# Altium project ALCT_MEZ_LX100.PrjPcb (part 6 of 8)

## Sheet EEPROM.SchDoc: EEPROM
size A; Organization: UCLA High Energy Physics; Address1: L3, 12a Rodborough Rd; Address2: Frenchs Forest; Address3: NSW; Address4: Australia 2086; DocumentNumber: 13; Revision: 2.0; SheetNumber: 13; SheetTotal: 23; CurrentDate: 9/6/2018; ModifiedDate: 9/6/2018; ProjectName: Project
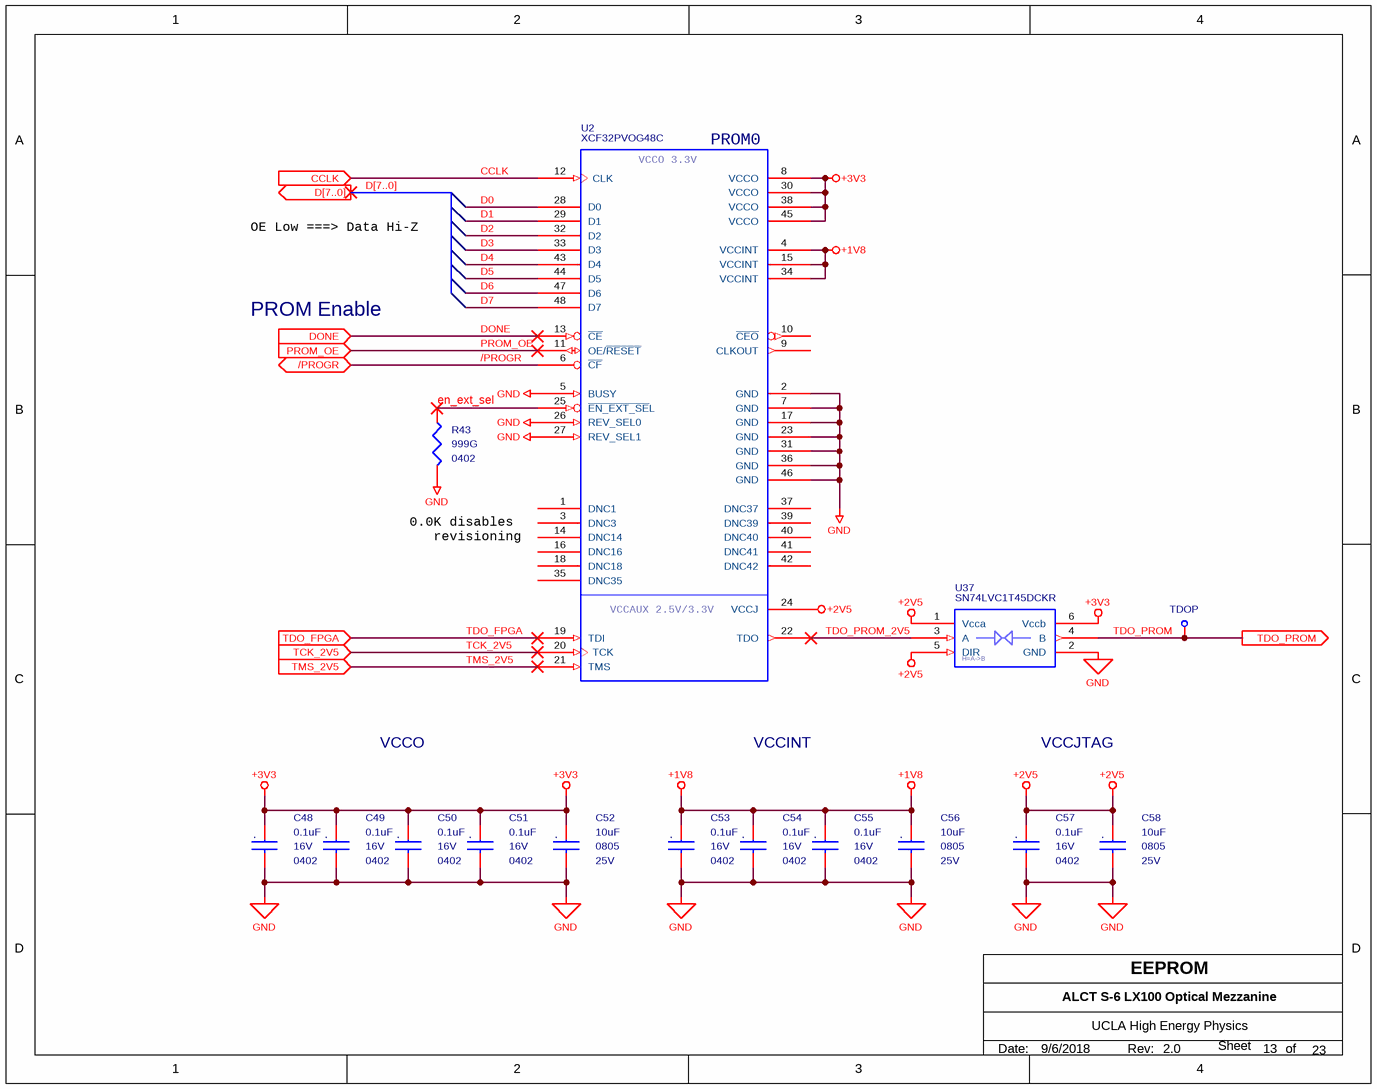
[diagram p21: EEPROM.SchDoc]

### Parts
C48  0.1uF  package: 0402  Voltage - Rated: 16V  [MC_S6/SM/C_0402_IPC]
C49  0.1uF  package: 0402  Voltage - Rated: 16V  [MC_S6/SM/C_0402_IPC]
C50  0.1uF  package: 0402  Voltage - Rated: 16V  [MC_S6/SM/C_0402_IPC]
C51  0.1uF  package: 0402  Voltage - Rated: 16V  [MC_S6/SM/C_0402_IPC]
C52  10uF  Voltage - Rated: 25V  package: 0805  [MC_S6/SM/C_0805_IPC]
C53  0.1uF  package: 0402  Voltage - Rated: 16V  [MC_S6/SM/C_0402_IPC]
C54  0.1uF  package: 0402  Voltage - Rated: 16V  [MC_S6/SM/C_0402_IPC]
C55  0.1uF  package: 0402  Voltage - Rated: 16V  [MC_S6/SM/C_0402_IPC]
C56  10uF  Voltage - Rated: 25V  package: 0805  [MC_S6/SM/C_0805_IPC]
C57  0.1uF  package: 0402  Voltage - Rated: 16V  [MC_S6/SM/C_0402_IPC]
C58  10uF  Voltage - Rated: 25V  package: 0805  [MC_S6/SM/C_0805_IPC]
R43  999G  Supplier Device Package: 0402  [MC_S6/SM/R_0402_IPC]  (no BOM)
TDOP  Test Point Via  [MC_S6/TH/TPVIA]  (value not drawn)  (no BOM)
U2  XCF32PVOG48C  [MC_S6/SM/VOG48]
U37  SN74LVC1T45DCKR  [MC_S6/SM/SOT_SC70_DCK6]

### Ports
/PROGR (bidir), CCLK (in), D[7..0] (out), DONE (in), PROM_OE (in), TCK_2V5 (in), TDO_FPGA (in), TDO_PROM (out), TMS_2V5 (in)

### Nets
+1V8: C53.1 C54.1 C55.1 C56.1 U2.4(VCCINT) U2.15(VCCINT) U2.34(VCCINT)
+2V5: C57.1 C58.1 U2.24(VCCJ) U37.1(Vcca) U37.5(DIR)
+3V3: C48.1 C49.1 C50.1 C51.1 C52.1 U2.8(VCCO) U2.30(VCCO) U2.38(VCCO) U2.45(VCCO) U37.6(Vccb)
GND: C48.2 C49.2 C50.2 C51.2 C52.2 C53.2 C54.2 C55.2 C56.2 C57.2 C58.2 R43.2 U2.2(GND) U2.5(BUSY) U2.7(GND) U2.17(GND) U2.23(GND) U2.26(REV_SEL0) U2.27(REV_SEL1) U2.31(GND) U2.36(GND) U2.46(GND) U37.2(GND)
/PROGR: U2.6(~{CF}) ; port /PROGR
CCLK: U2.12(CLK) ; port CCLK
D0: U2.28(D0)
D1: U2.29(D1)
D2: U2.32(D2)
D3: U2.33(D3)
D4: U2.43(D4)
D5: U2.44(D5)
D6: U2.47(D6)
D7: U2.48(D7)
DONE: U2.13(~{CE}) ; port DONE
en_ext_sel: R43.1 U2.25(~{EN_EXT_SE}L)
PROM_OE: U2.11(OE/~{RESET}) ; port PROM_OE
TCK_2V5: U2.20(TCK) ; port TCK_2V5
TDO_FPGA: U2.19(TDI) ; port TDO_FPGA
TDO_PROM: TDOP.1(In) U37.4(B) ; port TDO_PROM
TDO_PROM_2V5: U2.22(TDO) U37.3(A)
TMS_2V5: U2.21(TMS) ; port TMS_2V5

Not connected (* = marked no-connect by the designer): U2 1(DNC1) 3(DNC3) 9(CLKOUT) 10(~{CEO}) 14(DNC14) 16(DNC16) 18(DNC18) 35(DNC35) 37(DNC37) 39(DNC39) 40(DNC40) 41(DNC41) 42(DNC42)

### Buses and harness runs
bus D[7..0] = port D[7..0]

### Notes on the sheet
- (near U2) PROM0
- OE Low ===> Data Hi-Z
- PROM Enable
- 0.0K disables
  revisioning
- VCCO
- VCCINT
- VCCJTAG
- Date:
- Rev:
- of
- Sheet
- (in symbol C0402C104K4RACTU) .
- (in symbol GRM21BR61E106KA73L) .
- (in symbol SN74LVC1T45-EP-ALCT_1) H=A->B
- (in symbol XCF32PVOG48C) VCCO 3.3V; VCCAUX 2.5V/3.3V

### Library data of the parts
C48-C51 C53-C55 C57 = C0402C104K4RACTU: CAP CER 0.1UF 16V X7R 0402; Manufacturer: KEMET; Capacitance: 0.10µF; Tolerance: ±10%; Supplier 1: Digi-Key; Manufacturer Part Number: C0402C104K4RACTU; RoHS: RoHS Compliant; Category: Capacitors; Stock 1: 3565698; Pricing 1: 1=0.11, 10=0.078, 25=0.0568, 50=0.0442, 100=0.0365, 250=0.03024, 500=0.02562, 1000=0.02121, 5000=0.01806 (USD); Packaging: Cut Tape (CT); Part Status: Active; Operating Temperature: -55°C ~ 125°C; Features: -; Ratings: -; Applications: General Purpose; Failure Rate: -; Mounting Type: Surface Mount, MLCC; Package / Case: 0402 (1005 Metric); Size / Dimension: 0.039" L x 0.020" W (1.00mm x 0.50mm); Height - Seated (Max): -; Thickness (Max): 0.022" (0.55mm); Lead Spacing: -; Lead Style: -; ComponentLink1URL: http://www.kemet.com/docfinder?Partnumber=C0402C104K4RACTU; ComponentLink1Description: http://www.kemet.com/docfinder?Partnumber=C0402C104K4RACTU; Supplier 2: Digi-Key; Stock 2: 3565998; Pricing 2: 1=0.11, 10=0.078, 25=0.0568, 50=0.0442, 100=0.0365, 250=0.03024, 500=0.02562, 1000=0.02121, 5000=0.01806 (USD); Supplier Part Number 1: 399-3521-1-ND; Supplier Part Number 2: 399-3521-6-ND; Temperature Coefficient: X7R
C52 C56 C58 = GRM21BR61E106KA73L: CAP CER 10UF 25V X5R 0805; Manufacturer: Murata Electronics North America; Capacitance: 10µF; Tolerance: ±10%; Supplier 1: Digi-Key; Manufacturer Part Number: GRM21BR61E106KA73L; RoHS: RoHS Compliant; Category: Capacitors; Stock 1: 607428; Pricing 1: 1=0.19, 10=0.13, 50=0.0748, 100=0.0618, 250=0.052, 500=0.04356, 1000=0.03575 (USD); Packaging: Cut Tape (CT); Part Status: Active; Operating Temperature: -55°C ~ 85°C; Mounting Type: Surface Mount, MLCC; Size / Dimension: 0.079" L x 0.049" W (2.00mm x 1.25mm); Height - Seated (Max): -; Lead Spacing: -; Features: -; ComponentLink1URL: http://www.murata.com/~/media/webrenewal/support/library/catalog/products/capacitor/mlcc/c02e.pdf; ComponentLink1Description: http://www.murata.com/~/media/webrenewal/support/library/catalog/products/capacitor/mlcc/c02e.pdf; Supplier 2: Digi-Key; Supplier Part Number 1: 490-5523-1-ND; Supplier Part Number 2: 490-5523-6-ND; Package / Case: 0805 (2012 Metric); Temperature Coefficient: X5R; Ratings: -; Applications: General Purpose; Thickness (Max): 0.053" (1.35mm); Lead Style: -
R43 = RES999G 0402: RES SMD 999G OHM 5% 1/16W 0402; Manufacturer Part Number: Do Not Place
TDOP = TPVIA: COMPSIDE: TOP; COMPGROUP: 0; mfgr: Layout; COMPROT: 0; Package: 90; mfgr_id: TPVIA; mfgr_foot: TPVIA
U2 = XCF32PVOG48C: IC PROM SRL/PAR 1.8V 32M 48TSOP; Manufacturer: Xilinx Inc.; COMPSIDE: TOP; COMPGROUP: 0; COMPROT: 270; mfgr: Xilinx; mfgr_foot: VOG48; Programmable Type: In System Programmable; Memory Size: 32Mb; Voltage - Supply: 1.65 V ~ 2 V; mfgr_id: XCF32PVOG48C; Supplier 1: Digi-Key; Manufacturer Part Number: XCF32PVOG48C; RoHS: RoHS Compliant; Category: Integrated Circuits (ICs); Stock 1: 1063; Pricing 1: 1=27.23 (USD); Packaging: Tube; Part Status: Active; Operating Temperature: -40°C ~ 85°C; Package / Case: 48-TFSOP (0.724", 18.40mm Width); Supplier Device Package: 48-TSOP; ComponentLink1URL: http://www.xilinx.com/support/documentation/data_sheets/ds123.pdf; ComponentLink1Description: http://www.xilinx.com/support/documentation/data_sheets/ds123.pdf; Supplier Part Number 1: 122-1458-ND
U37 = SN74LVC1T45-EP-ALCT_1: IC BUS TRANSCVR TRI-ST SC70-6; Manufacturer: Texas Instruments; COMPSIDE: TOP; COMPGROUP: 0; COMPROT: 270; mfgr_id: SN74LVC1T45MDCKREP; mfgr: Texas Inst; mfgr_foot: DCK; Translator Type: Voltage Level; Channel Type: Bidirectional; Channels per Circuit: 1; Output Type: Tri-State, Non-Inverted; Data Rate: 420Mbps; Supplier 1: Digi-Key; Manufacturer Part Number: SN74LVC1T45DCKR; RoHS: RoHS Compliant; Category: Integrated Circuits (ICs); Stock 1: 91787; Pricing 1: 1=0.58, 10=0.494, 100=0.3692, 500=0.29004, 1000=0.22413 (USD); Packaging: Cut Tape (CT); Part Status: Active; Input Signal: -; Output Signal: -; Operating Temperature: -40°C ~ 85°C (TA); Features: -; Mounting Type: Surface Mount; Package / Case: 6-TSSOP, SC-88, SOT-363; Supplier Device Package: SC-70-6; ComponentLink1URL: http://www.ti.com/lit/ds/symlink/sn74lvc1t45.pdf; ComponentLink1Description: http://www.ti.com/lit/ds/symlink/sn74lvc1t45.pdf; Supplier 2: Digi-Key; Stock 2: 91787; Pricing 2: 1=0.58, 10=0.494, 100=0.3692, 500=0.29004, 1000=0.22413 (USD); Supplier Part Number 1: 296-16844-1-ND; Supplier Part Number 2: 296-16844-6-ND

## Sheet GBTx_Control.SchDoc: GBTx Control
size A; Organization: UCLA High Energy Physics; Address1: L3, 12a Rodborough Rd; Address2: Frenchs Forest; Address3: NSW; Address4: Australia 2086; DocumentNumber: 17; Revision: 2.0; SheetNumber: 17; SheetTotal: 23; CurrentDate: 9/6/2018; ModifiedDate: 9/6/2018; ProjectName: Project
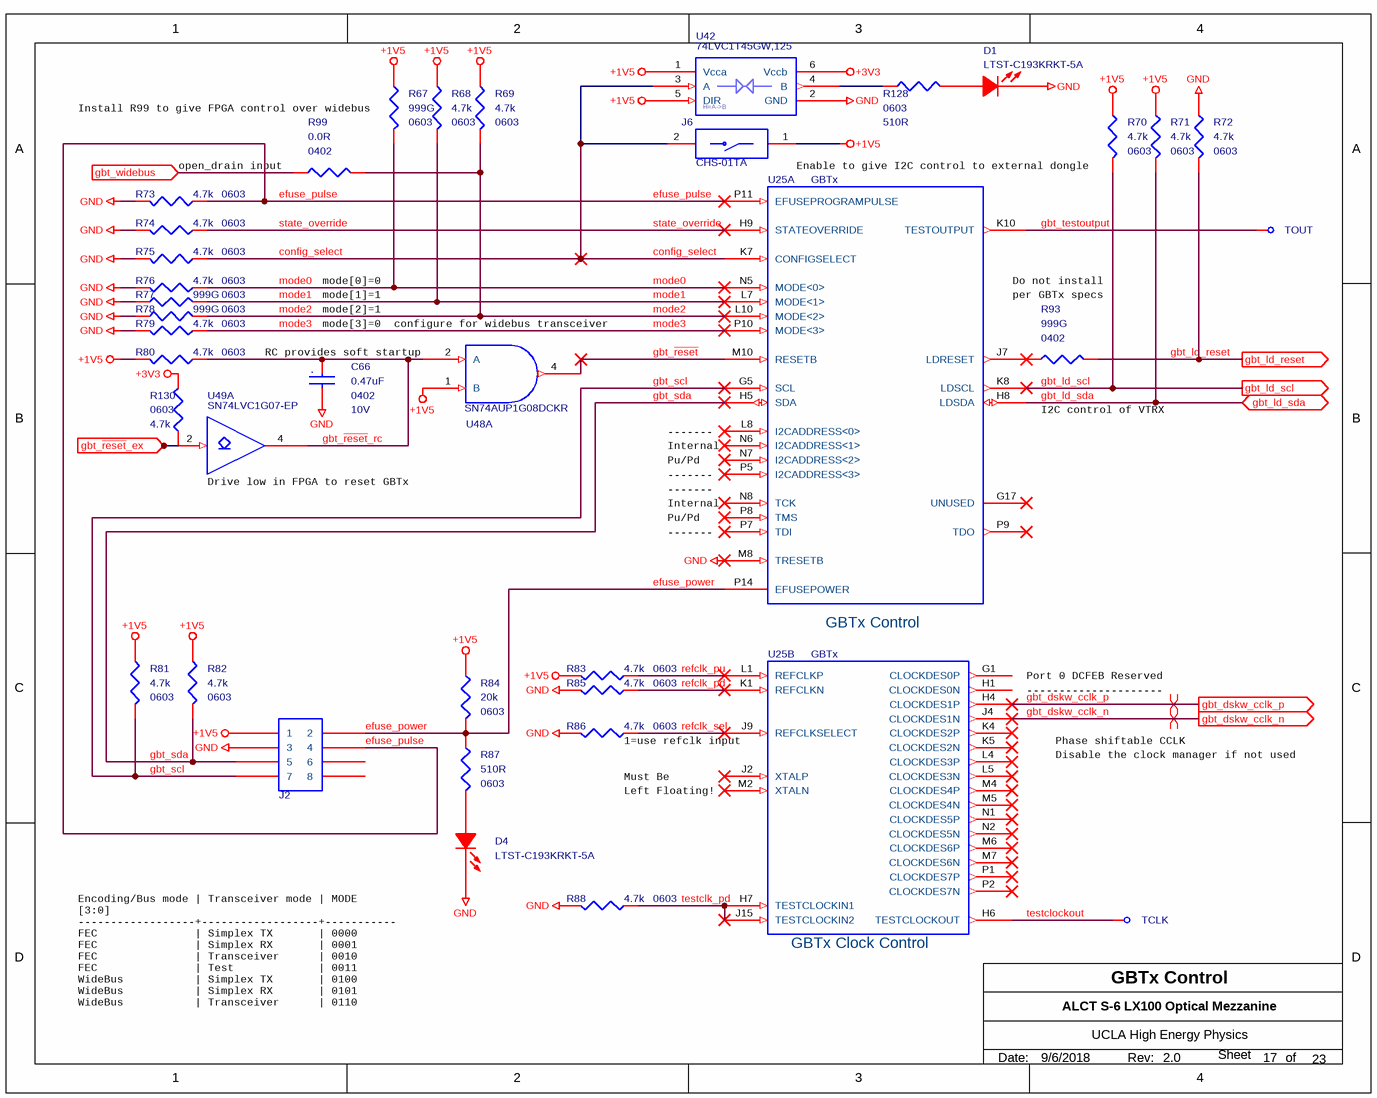
[diagram p22: GBTx_Control.SchDoc]

### Parts
C66  0.47uF  package: 0402  Voltage - Rated: 10V  [MC_S6/SM/C_0402_IPC]
D1  LTST-C193KRKT-5A  [MC_S6/SM/LED_0603]
D4  LTST-C193KRKT-5A  [MC_S6/SM/LED_0603]
J2  CON8 SMD  [MC_S6/SM/WURTH_61200820621]  (value not drawn)
J6  CHS-01TA  [CHS-01TA]
R67  999G  Supplier Device Package: 0603  [MC_S6/SM/R_0603_IPC]  (no BOM)
R68  4.7k  Supplier Device Package: 0603  [MC_S6/SM/R_0603_IPC]
R69  4.7k  Supplier Device Package: 0603  [MC_S6/SM/R_0603_IPC]
R70  4.7k  Supplier Device Package: 0603  [MC_S6/SM/R_0603_IPC]
R71  4.7k  Supplier Device Package: 0603  [MC_S6/SM/R_0603_IPC]
R72  4.7k  Supplier Device Package: 0603  [MC_S6/SM/R_0603_IPC]
R73  4.7k  Supplier Device Package: 0603  [MC_S6/SM/R_0603_IPC]
R74  4.7k  Supplier Device Package: 0603  [MC_S6/SM/R_0603_IPC]
R75  4.7k  Supplier Device Package: 0603  [MC_S6/SM/R_0603_IPC]
R76  4.7k  Supplier Device Package: 0603  [MC_S6/SM/R_0603_IPC]
R77  999G  Supplier Device Package: 0603  [MC_S6/SM/R_0603_IPC]  (no BOM)
R78  999G  Supplier Device Package: 0603  [MC_S6/SM/R_0603_IPC]  (no BOM)
R79  4.7k  Supplier Device Package: 0603  [MC_S6/SM/R_0603_IPC]
R80  4.7k  Supplier Device Package: 0603  [MC_S6/SM/R_0603_IPC]
R81  4.7k  Supplier Device Package: 0603  [MC_S6/SM/R_0603_IPC]
R82  4.7k  Supplier Device Package: 0603  [MC_S6/SM/R_0603_IPC]
R83  4.7k  Supplier Device Package: 0603  [MC_S6/SM/R_0603_IPC]
R84  20k  Supplier Device Package: 0603  [MC_S6/SM/R_0603_IPC]
R85  4.7k  Supplier Device Package: 0603  [MC_S6/SM/R_0603_IPC]
R86  4.7k  Supplier Device Package: 0603  [MC_S6/SM/R_0603_IPC]
R87  510R  Supplier Device Package: 0603  [MC_S6/SM/R_0603_IPC]
R88  4.7k  Supplier Device Package: 0603  [MC_S6/SM/R_0603_IPC]
R93  999G  Supplier Device Package: 0402  [MC_S6/SM/R_0402_IPC]  (no BOM)
R99  0.0R  Supplier Device Package: 0402  [MC_S6/SM/R_0402_IPC]
R128  510R  Supplier Device Package: 0603  [MC_S6/SM/R_0603_IPC]
R130  4.7k  Supplier Device Package: 0603  [MC_S6/SM/R_0603_IPC]
TCLK  Test Point Via  [MC_S6/TH/TPVIA]  (value not drawn)  (no BOM)
TOUT  Test Point Via  [MC_S6/TH/TPVIA]  (value not drawn)  (no BOM)
U25  GBTx  [BGA400 GBT]  (parts A,B of 8)
U42  74LVC1T45GW,125  [SOT363]
U48  SN74AUP1G08DCKR  [MC_S6/SM/SOT_SC70_DCK5]  (part A of 2)
U49  SN74LVC1G07-EP  [SOT353-1]  (part A of 2)

### Ports
gbt_dskw_cclk_n (out), gbt_dskw_cclk_p (out), gbt_ld_reset (out), gbt_ld_scl (out), gbt_ld_sda (bidir), gbt_widebus (in), gbt_~{reset}_ex (in)

### Nets
+1V5: J2.1 J6.1 R67.1 R68.1 R69.1 R70.1 R71.1 R80.2 R81.1 R82.1 R83.2 R84.1 U42.1(Vcca) U42.5(DIR) U48.1(B)
+3V3: R130.2 U42.6(Vccb)
GND: C66.2 D1.K(CATHODE) D4.K(CATHODE) J2.3 R72.1 R73.2 R74.2 R75.2 R76.2 R77.1 R78.1 R79.2 R85.2 R86.2 R88.2 U25.M8(TRESETB) U42.2(GND)
config_select: J6.2 R75.1 U25.K7(CONFIGSELECT) U42.3(A)
efuse_power: J2.2 R84.2 R87.1 U25.P14(EFUSEPOWER)
efuse_pulse: J2.4 R73.1 U25.P11(EFUSEPROGRAMPULSE)
gbt_dskw_cclk_n: U25.J4(CLOCKDES1N) ; port gbt_dskw_cclk_n
gbt_dskw_cclk_p: U25.H4(CLOCKDES1P) ; port gbt_dskw_cclk_p
gbt_ld_reset: R72.2 R93.2 ; port gbt_ld_reset
gbt_ld_scl: R70.2 U25.K8(LDSCL) ; port gbt_ld_scl
gbt_ld_sda: R71.2 U25.H8(LDSDA) ; port gbt_ld_sda
gbt_~{reset}: U25.M10(RESETB) U48.4(Y)
gbt_~{reset}_ex: R130.1 U49.2(A) ; port gbt_~{reset}_ex
gbt_~{reset}_rc: C66.1 R80.1 U48.2(A) U49.4(Y)
gbt_scl: J2.7 R81.2 U25.G5(SCL)
gbt_sda: J2.5 R82.2 U25.H5(SDA)
gbt_testoutput: TOUT.1(In) U25.K10(TESTOUTPUT)
gbt_widebus: R99.1 ; port gbt_widebus
mode0: R67.2 R76.1 U25.N5(MODE<0>)
mode1: R68.2 R77.2 U25.L7(MODE<1>)
mode2: R69.2 R78.2 R99.2 U25.L10(MODE<2>)
mode3: R79.1 U25.P10(MODE<3>)
refclk_pd: R85.1 U25.K1(REFCLKN)
refclk_pu: R83.1 U25.L1(REFCLKP)
refclk_sel: R86.1 U25.J9(REFCLKSELECT)
state_override: R74.1 U25.H9(STATEOVERRIDE)
testclk_pd: R88.1 U25.H7(TESTCLOCKIN1) U25.J15(TESTCLOCKIN2)
testclockout: TCLK.1(In) U25.H6(TESTCLOCKOUT)
NetD1_A: D1.A(ANODE) R128.2
NetD4_A: D4.A(ANODE) R87.2
NetR93_1: R93.1 U25.J7(LDRESET)
NetR128_1: R128.1 U42.4(B)

Not connected (* = marked no-connect by the designer): J2 6 8; U25 G1(CLOCKDES0P) G17(UNUSED)* H1(CLOCKDES0N) J2(XTALP)* K4(CLOCKDES2P)* K5(CLOCKDES2N)* L4(CLOCKDES3P)* L5(CLOCKDES3N)* L8(I2CADDRESS<0>)* M2(XTALN)* M4(CLOCKDES4P)* M5(CLOCKDES4N)* M6(CLOCKDES6P)* M7(CLOCKDES6N)* N1(CLOCKDES5P)* N2(CLOCKDES5N)* N6(I2CADDRESS<1>)* N7(I2CADDRESS<2>)* N8(TCK)* P1(CLOCKDES7P)* P2(CLOCKDES7N)* P5(I2CADDRESS<3>)* P7(TDI)* P8(TMS)* P9(TDO)*

### Layout directives
differential pair: gbt_dskw_cclk_n, gbt_dskw_cclk_p

### Notes on the sheet
- Install R99 to give FPGA control over widebus
- open_drain input
- Enable to give I2C control to external dongle
- mode[0]=0
- mode[1]=1
- mode[2]=1
- (near C66) mode[3]=0
- (near U48) configure for widebus transceiver
- (near U25) Do not install
- (near U25) per GBTx specs
- (near C66) RC provides soft startup
- Pu/Pd
- Internal
- -------
- I2C control of VTRX
- (near U49) Drive low in FPGA to reset GBTx
- Port 0 DCFEB Reserved
- ---------------------
- (near R86) 1=use refclk input
- Phase shiftable CCLK
- Disable the clock manager if not used
- Left Floating!
- (near R86) Must Be
- Encoding/Bus mode | Transceiver mode | MODE [3:0]
  ------------------+------------------+-----------
  FEC               | Simplex TX       | 0000
  FEC               | Simplex RX       | 0001
  FEC               | Transceiver      | 0010
  FEC               | Test             | 0011
  WideBus           | Simplex TX       | 0100
  WideBus           | Simplex RX       | 0101
  WideBus           | Transceiver      | 0110
- Date:
- Rev:
- of
- Sheet
- (in symbol 74LVC1T45) H=A->B
- (in symbol GBTx, part A) GBTx Control
- (in symbol GBTx, part B) GBTx Clock Control
- (in symbol GRM155R61A474KE15J) .

### Library data of the parts
C66 = GRM155R61A474KE15J: CAP CER 0.47UF 10V X5R 0402; Manufacturer: Murata Electronics North America; Capacitance: 0.47µF; Tolerance: ±10%; Supplier 1: Digi-Key; Manufacturer Part Number: GRM155R61A474KE15J; RoHS: RoHS Compliant; Category: Capacitors; Stock 1: 35266; Pricing 1: 1=0.1, 10=0.074, 100=0.0329, 500=0.02348, 1000=0.01845, 2500=0.01678, 5000=0.01543 (USD); Packaging: Cut Tape (CT); Part Status: Active; Operating Temperature: -55°C ~ 85°C; Features: -; Ratings: -; Applications: General Purpose; Mounting Type: Surface Mount, MLCC; Package / Case: 0402 (1005 Metric); Size / Dimension: 0.039" L x 0.020" W (1.00mm x 0.50mm); Height - Seated (Max): -; Thickness (Max): 0.022" (0.55mm); Lead Spacing: -; ComponentLink1URL: http://www.murata.com/~/media/webrenewal/support/library/catalog/products/capacitor/mlcc/c02e.ashx; ComponentLink1Description: http://www.murata.com/~/media/webrenewal/support/library/catalog/products/capacitor/mlcc/c02e.ashx; Supplier 2: Digi-Key; Stock 2: 35286; Pricing 2: 1=0.1, 10=0.074, 100=0.0329, 500=0.02348, 1000=0.01845, 2500=0.01678, 5000=0.01543 (USD); Supplier Part Number 1: 490-6305-1-ND; Supplier Part Number 2: 490-6305-6-ND; Temperature Coefficient: X5R
D1 D4 = LTST-C193KRKT-5A: LED RED CLEAR 0603 SMD; Manufacturer: Lite-On Inc.; Current - Test: 5mA; Lens Color: Colorless; Lens Style/Size: Rectangle with Flat Top, 1.15mm x 0.80mm; Millicandela Rating: 26.05mcd; Viewing Angle: 130°; Voltage - Forward (Vf) (Typ): 2V; Wavelength - Dominant: 631nm; Wavelength - Peak: 639nm; Category: Optoelectronics; Color: Red; ComponentLink1Description: http://optoelectronics.liteon.com/upload/download/DS22-2005-077/LTST-C193KRKT-5A.PDF; ComponentLink1URL: http://optoelectronics.liteon.com/upload/download/DS22-2005-077/LTST-C193KRKT-5A.PDF; Features: -; Height (Max): 0.45mm; Lens Transparency: Clear; Manufacturer Part Number: LTST-C193KRKT-5A; Mounting Type: Surface Mount; Package / Case: 0603 (1608 Metric); Packaging: Cut Tape (CT); Part Status: Active; Pricing 1: 1=0.41, 10=0.296, 25=0.2268, 100=0.148, 250=0.10852, 500=0.0921, 1000=0.07565, 2500=0.06578 (USD); Pricing 2: 1=0.41, 10=0.296, 25=0.2268, 100=0.148, 250=0.10852, 500=0.0921, 1000=0.07565, 2500=0.06578 (USD); RoHS: RoHS Compliant; Size / Dimension: 1.60mm L x 0.80mm W; Stock 1: 97257; Stock 2: 97257; Supplier 1: Digi-Key; Supplier 2: Digi-Key; Supplier Device Package: Chip LED; Supplier Part Number 1: 160-1830-1-ND; Supplier Part Number 2: 160-1830-6-ND
J2 = CON8 Wurth 61200820621: CONN HEADER 8 POS 2.54 SMD; Manufacturer: Wurth Electronics Inc.; Pitch - Mating: 0.100" (2.54mm); Number of Positions: 8; Number of Positions Loaded: All; Style: Board to Cable/Wire; Shrouding: Shrouded - 4 Wall; Contact Length - Mating: 0.200" (5.08mm); Material Flammability Rating: UL94 V-0; Current Rating: 3A; Voltage Rating: 250V; Supplier 1: Digi-Key; Manufacturer Part Number: 61200820621; RoHS: RoHS Compliant; Category: Connectors, Interconnects; Stock 1: 428; Pricing 1: 1=3.48, 100=3.1239, 500=2.6433 (USD); Packaging: Tube; Part Status: Active; Connector Type: Header; Contact Type: Male Pin; Number of Rows: 2; Row Spacing - Mating: 0.100" (2.54mm); Mounting Type: Surface Mount; Termination: Solder; Fastening Type: Push-Pull; Contact Length - Post: -; Overall Contact Length: -; Insulation Height: 0.365" (9.27mm); Contact Shape: Square; Contact Finish - Mating: Gold; Contact Finish Thickness - Mating: -; Contact Finish - Post: -; Contact Material: Copper Alloy; Insulation Material: Polyamide (PA6T), Nylon 6T; Features: Keying Slot, Pick and Place; Operating Temperature: -40°C ~ 125°C; Ingress Protection: -; Insulation Color: Black; Mated Stacking Heights: -; Contact Finish Thickness - Post: -; Applications: -; ComponentLink1URL: http://katalog.we-online.de/em/datasheet/6120xx20621.pdf; ComponentLink1Description: http://katalog.we-online.de/em/datasheet/6120xx20621.pdf; Supplier Part Number 1: 732-5476-5-ND
J6 = CHS-01TA: as J3-J5 on sheet Source_Select; ComponentLink1URL: https://www.ctscorp.com/wp-content/uploads/219.pdf; ComponentLink1Description: https://www.ctscorp.com/wp-content/uploads/219.pdf; Supplier 1: Digi-Key; Manufacturer Part Number: CHS-01TA; Stock 1: 148558; Pricing 1: 1=0.98, 10=0.961, 25=0.9056, 50=0.85, 100=0.8131, 250=0.77616, 500=0.70224 (USD); Mount: Surface Mount; Contact Material: Copper Alloy; Contact Plating: Gold; Min Operating Temperature: -40°C; Max Operating Temperature: 85°C; Packaging: Tape and Reel; Throw Configuration: SPST; Voltage Rating (DC): 6V; Current Rating: 100mA; Termination: J-Hook; Orientation: Vertical; Length: 0.098inch; Lead Free: Lead Free; ComponentLink2URL: https://datasheet.ciiva.com/2863/chs-2863448.pdf; ComponentLink2Description: https://datasheet.ciiva.com/2863/chs-2863448.pdf; ComponentLink3URL: https://datasheet.ciiva.com/2863/chs-2863449.pdf; ComponentLink3Description: https://datasheet.ciiva.com/2863/chs-2863449.pdf; ComponentLink4URL: https://datasheet.ciiva.com/2863/chs-2863450.pdf; ComponentLink4Description: https://datasheet.ciiva.com/2863/chs-2863450.pdf; Supplier Part Number 1: 563-1003-1-ND
R67 R77 = RES999G 0603: RES SMD 999G OHM 5% 1/10W 0603; Manufacturer Part Number: Do Not Place
R68-R76 R79-R83 R85 R86 R88 R130 = CR0603-FX-4701ELF: as R44-R50 on sheet Source_Select; Supplier 1: Digi-Key; Manufacturer Part Number: CR0603-FX-4701ELF; RoHS: RoHS Compliant; Category: Resistors; Stock 1: 43560; Pricing 1: 1=0.1, 10=0.021, 100=0.0086, 1000=0.00385, 2500=0.00334 (USD); Packaging: Cut Tape (CT); Part Status: Active; Resistance (Ohms): 4.7k; Tolerance: ±1%; Composition: Thick Film; Features: Moisture Resistant; Operating Temperature: -55°C ~ 155°C; Package / Case: 0603 (1608 Metric); Size / Dimension: 0.063" L x 0.031" W (1.60mm x 0.80mm); Height - Seated (Max): 0.022" (0.55mm); Failure Rate: -; ComponentLink1URL: http://www.bourns.com/docs/Product-Datasheets/CHPREZTR.pdf; ComponentLink1Description: http://www.bourns.com/docs/Product-Datasheets/CHPREZTR.pdf; Supplier 2: Digi-Key; Stock 2: 43560; Pricing 2: 1=0.1, 10=0.021, 100=0.0086, 1000=0.00385, 2500=0.00334 (USD); Supplier Part Number 1: CR0603-FX-4701ELFCT-ND; Supplier Part Number 2: CR0603-FX-4701ELFDKR-ND
R78 = RES999G: RES SMD 999G OHM 5% 1/10W 0603; Manufacturer Part Number: Do Not Place
R84 = CR0603-FX-2002ELF: RES SMD 20K OHM 1% 1/10W 0603; Manufacturer: Bourns Inc.; Power (Watts): 0.1W, 1/10W; Temperature Coefficient: ±100ppm/°C; Category: Resistors; ComponentLink1Description: http://www.bourns.com/docs/Product-Datasheets/CHPREZTR.pdf; ComponentLink1URL: http://www.bourns.com/docs/Product-Datasheets/CHPREZTR.pdf; Composition: Thick Film; Failure Rate: -; Features: Moisture Resistant; Height - Seated (Max): 0.022" (0.55mm); Manufacturer Part Number: CR0603-FX-2002ELF; Operating Temperature: -55°C ~ 155°C; Package / Case: 0603 (1608 Metric); Packaging: Cut Tape (CT); Part Status: Active; Pricing 1: 1=0.1, 10=0.021, 100=0.0086, 1000=0.00385, 2500=0.00334 (USD); Pricing 2: 1=0.1, 10=0.021, 100=0.0086, 1000=0.00385, 2500=0.00334 (USD); RoHS: RoHS Compliant; Size / Dimension: 0.063" L x 0.032" W (1.60mm x 0.80mm); Stock 1: 1108; Stock 2: 1108; Supplier 1: Digi-Key; Supplier 2: Digi-Key; Supplier Part Number 1: CR0603-FX-2002ELFCT-ND; Supplier Part Number 2: CR0603-FX-2002ELFDKR-ND; Tolerance: ±1%
R87 R128 = CR0603-FX-5100ELF: RES SMD 510 OHM 1% 1/10W 0603; Manufacturer: Bourns Inc.; Power (Watts): 0.1W, 1/10W; Temperature Coefficient: ±100ppm/°C; Supplier 1: Digi-Key; Manufacturer Part Number: CR0603-FX-5100ELF; RoHS: RoHS Compliant; Category: Resistors; Stock 1: 523; Pricing 1: 1=0.1, 10=0.021, 100=0.0086, 1000=0.00385, 2500=0.00334 (USD); Packaging: Digi-Reel®; Part Status: Active; Composition: Thick Film; Features: Moisture Resistant; Operating Temperature: -55°C ~ 155°C; Package / Case: 0603 (1608 Metric); Size / Dimension: 0.063" L x 0.032" W (1.60mm x 0.80mm); Height - Seated (Max): 0.022" (0.55mm); Failure Rate: -; ComponentLink1URL: https://www.bourns.com/docs/Product-Datasheets/CHPREZTR.pdf; ComponentLink1Description: https://www.bourns.com/docs/Product-Datasheets/CHPREZTR.pdf; Supplier Part Number 1: CR0603-FX-5100ELFDKR-ND; Tolerance: ±1%
R93 = RES999G 0402: as R43 on sheet EEPROM
R99 = RC1005J000CS: RES SMD 0.0OHM JUMPER 1/16W 0402; Manufacturer: Samsung Electro-Mechanics America, Inc.; Resistance (Ohms): 0.0; Power (Watts): 0.063W, 1/16W; Manufacturer Part Number: RC1005J000CS; Supplier 1: Digi-Key; RoHS: RoHS Compliant; Category: Resistors; Stock 1: 3176408; Pricing 1: 1=0.1, 10=0.01, 25=0.0076, 50=0.0056, 100=0.0042, 250=0.0032, 500=0.00256, 1000=0.00188, 5000=0.00135 (USD); Packaging: Cut Tape (CT); Part Status: Active; Tolerance: Jumper; Composition: Thick Film; Features: Moisture Resistant; Temperature Coefficient: -; Operating Temperature: -55°C ~ 155°C; Package / Case: 0402 (1005 Metric); Size / Dimension: 0.039" L x 0.020" W (1.00mm x 0.50mm); Height - Seated (Max): 0.016" (0.40mm); Failure Rate: -; ComponentLink1URL: http://www.samsungsem.com/kr/support/library/product-catalog/chip_resistor.jsp; ComponentLink1Description: http://www.samsungsem.com/kr/support/library/product-catalog/chip_resistor.jsp; Supplier 2: Digi-Key; Stock 2: 3176408; Pricing 2: 1=0.1, 10=0.01, 25=0.0076, 50=0.0056, 100=0.0042, 250=0.0032, 500=0.00256, 1000=0.00188, 5000=0.00135 (USD); Supplier Part Number 1: 1276-3480-1-ND; Supplier Part Number 2: 1276-3480-6-ND
TCLK TOUT = TPVIA: as TDOP on sheet EEPROM; COMPROT: 0; Package: 90; mfgr_id: TPVIA; mfgr_foot: TPVIA
U42 = 74LVC1T45: IC BUS TRANSCVR TRI-ST SC70-6; Manufacturer: NXP Semiconductors; Number of Channels: 1; Min Supply Voltage: 1.2V; Max Supply Voltage: 5.5V; Propagation Delay: 48.6ns; Max Power Dissipation: 250mW; Data Rate: 420Mbps; Direction: Bidirectional; Logic Function: Transceiver,Translator; Polarity: Non-Inverting; High Level Output Current: -32mA; Low Level Output Current: 32mA; Quiescent Current: 16uA; Voltage: 5V; ComponentLink1URL: http://www.ti.com/lit/ds/symlink/sn74lvc1t45.pdf; ComponentLink1Description: http://www.ti.com/lit/ds/symlink/sn74lvc1t45.pdf; Supplier 1: Digi-Key; Manufacturer Part Number: 74LVC1T45GW,125; Stock 1: 0; Mount: Surface Mount; Case/Package: TSSOP; Number of Pins: 6; Contact Plating: Tin; Min Operating Temperature: -40°C; Max Operating Temperature: 125°C; Packaging: Tape and Reel; Package Quantity: 3000; Number of Elements: 1; Number of Bits: 1; Turn-On Delay Time: 48.6ns; Max Supply Voltage (DC): 5.5V; Max Voltage Rating (DC): 5.5V; Radiation Hardening: No; REACH SVHC: No SVHC; Lead Free: Lead Free; ComponentLink2URL: https://datasheet.ciiva.com/1898/74lvc-lvch1t45-1898948.pdf; ComponentLink2Description: https://datasheet.ciiva.com/1898/74lvc-lvch1t45-1898948.pdf; ComponentLink3URL: https://datasheet.ciiva.com/1898/74lvc-lvch1t45-1898949.pdf; ComponentLink3Description: https://datasheet.ciiva.com/1898/74lvc-lvch1t45-1898949.pdf; ComponentLink4URL: https://datasheet.ciiva.com/1898/74lvc-lvch1t45-1898950.pdf; ComponentLink4Description: https://datasheet.ciiva.com/1898/74lvc-lvch1t45-1898950.pdf; ComponentLink5URL: https://datasheet.ciiva.com/26940/getdatasheetpartid-436223-26940411.pdf; ComponentLink5Description: https://datasheet.ciiva.com/26940/getdatasheetpartid-436223-26940411.pdf; ComponentLink6URL: https://datasheet.ciiva.com/16222/74lvc-lvch1t45-16222076.pdf; ComponentLink6Description: https://datasheet.ciiva.com/16222/74lvc-lvch1t45-16222076.pdf; Supplier Part Number 1: 1727-4560-1-ND
U48 = SN74AUP1G08DCKR: IC GATE AND 1CH 2-INP 5-TSSOP; Manufacturer: Texas Instruments; Manufacturer Part Number: SN74AUP1G08DCKT; Logic Type: AND Gate; Number of Inputs: 2; Voltage - Supply: 0.8 V ~ 3.6 V; Current - Output High, Low: 4mA, 4mA; Logic Level - Low: 0.7 V ~ 0.9 V; Logic Level - High: 1.6 V ~ 2 V; Max Propagation Delay @ V, Max CL: 6.2ns @ 3.3V, 30pF; Supplier 1: Digi-Key; RoHS: RoHS Compliant; Category: Integrated Circuits (ICs); Stock 1: 7470; Pricing 1: 1=0.8, 10=0.707, 100=0.542 (USD); Packaging: Cut Tape (CT); Part Status: Active; Features: -; Operating Temperature: -40°C ~ 85°C; Mounting Type: Surface Mount; Supplier Device Package: SC-70-5; Package / Case: 5-TSSOP, SC-70-5, SOT-353; ComponentLink1URL: http://www.ti.com/lit/ds/symlink/sn74aup1g08.pdf; ComponentLink1Description: http://www.ti.com/lit/ds/symlink/sn74aup1g08.pdf; Supplier 2: Digi-Key; Stock 2: 7470; Pricing 2: 1=0.8, 10=0.707, 100=0.542 (USD); Supplier Part Number 1: 296-32258-1-ND; Supplier Part Number 2: 296-32258-6-ND
U49 = SN74LVC1G07-EP: IC BUFF/DVR NON-INVERT Open Drain SC70-5; Manufacturer: Texas Instruments; mfgr_id: SN74LVC1G07MDCKREP; mfgr: Texas Inst; mfgr_foot: DCK; COMPROT: 270; COMPGROUP: 0; COMPSIDE: TOP; Logic Type: Buffer, Non-Inverting; Number of Bits per Element: 1; Current - Output High, Low: -, 32mA; Voltage - Supply: 1.65 V ~ 5.5 V; Package: 99; Supplier 1: Digi-Key; Manufacturer Part Number: SN74LVC1G07MDCKREP; RoHS: RoHS Compliant; Category: Integrated Circuits (ICs); Stock 1: 4252; Pricing 1: 1=0.81, 10=0.714, 100=0.5472, 500=0.4326, 1000=0.34608 (USD); Packaging: Cut Tape (CT); Part Status: Active; Input Type: -; Output Type: Open Drain; Operating Temperature: -55°C ~ 125°C (TA); Mounting Type: Surface Mount; Package / Case: 5-TSSOP, SC-70-5, SOT-353; Supplier Device Package: SC-70-5; ComponentLink1URL: http://www.ti.com/lit/ds/symlink/sn74lvc1g07-ep.pdf; ComponentLink1Description: http://www.ti.com/lit/ds/symlink/sn74lvc1g07-ep.pdf; Supplier 2: Digi-Key; Stock 2: 4252; Pricing 2: 1=0.81, 10=0.714, 100=0.5472, 500=0.4326, 1000=0.34608 (USD); Supplier Part Number 1: 296-22343-1-ND; Supplier Part Number 2: 296-22343-6-ND